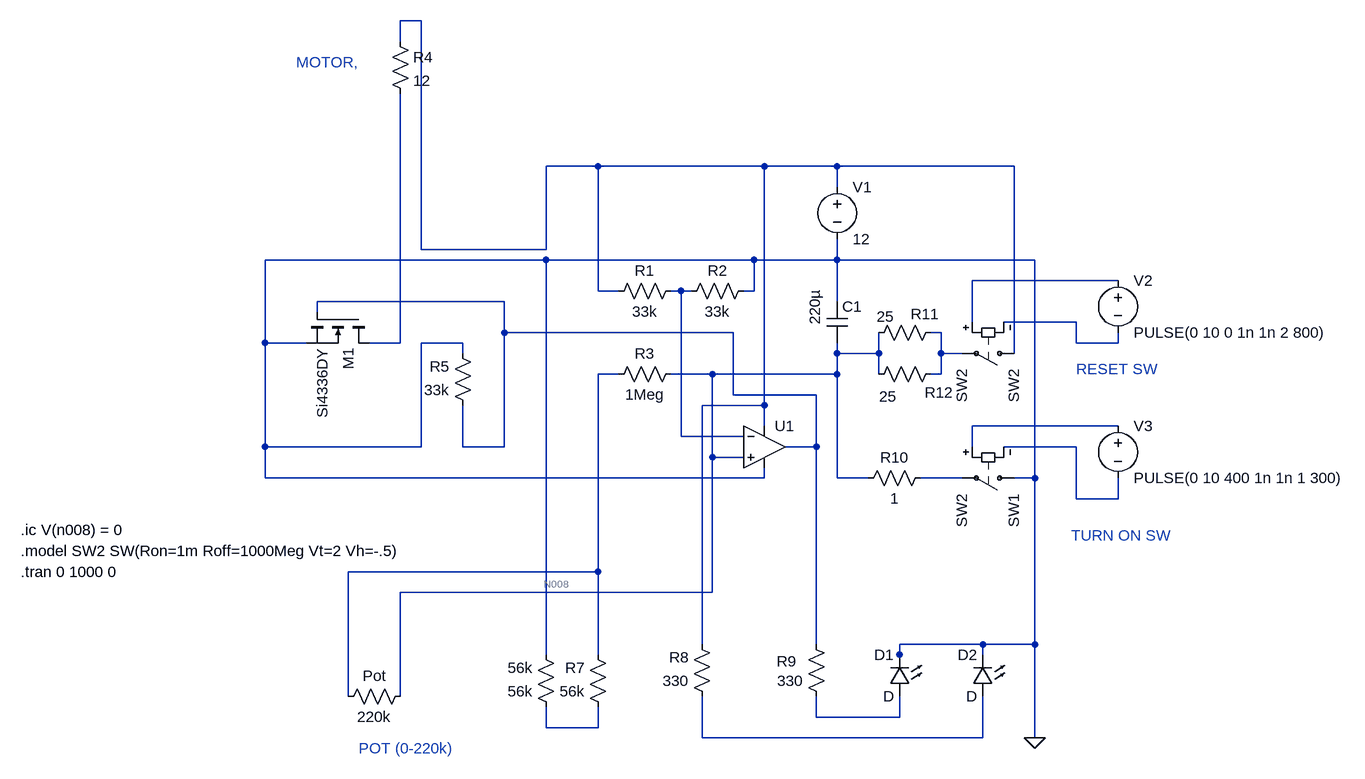
[diagram p0: schematic coffee-pump-timer-circuit.asc]
coffee-pump-timer-circuit.asc, the LTspice schematic file:
Version 4
SHEET 1 1792 704
WIRE -336 -432 -368 -432
WIRE -368 -400 -368 -432
WIRE -64 -208 -144 -208
WIRE 192 -208 -64 -208
WIRE 304 -208 192 -208
WIRE 576 -208 304 -208
WIRE 304 -176 304 -208
WIRE -336 -80 -336 -432
WIRE -144 -80 -144 -208
WIRE -144 -80 -336 -80
WIRE -144 -64 -576 -64
WIRE 176 -64 -144 -64
WIRE 304 -64 304 -96
WIRE 304 -64 176 -64
WIRE 608 -64 304 -64
WIRE 736 -32 512 -32
WIRE -64 -16 -64 -208
WIRE -32 -16 -64 -16
WIRE 64 -16 48 -16
WIRE 80 -16 64 -16
WIRE 176 -16 176 -64
WIRE 176 -16 160 -16
WIRE -208 0 -496 0
WIRE 304 0 304 -64
WIRE -496 16 -496 0
WIRE 512 32 512 -32
WIRE 672 32 560 32
WIRE -208 48 -208 0
WIRE 144 48 -208 48
WIRE 464 48 448 48
WIRE -576 64 -576 -64
WIRE -512 64 -576 64
WIRE -368 64 -368 -320
WIRE -368 64 -416 64
WIRE -272 64 -336 64
WIRE 672 64 672 32
WIRE 736 64 736 48
WIRE 736 64 672 64
WIRE -272 80 -272 64
WIRE 304 80 304 64
WIRE 368 80 368 48
WIRE 368 80 304 80
WIRE 464 80 464 48
WIRE 496 80 464 80
WIRE 576 80 576 -208
WIRE -32 112 -64 112
WIRE 112 112 48 112
WIRE 304 112 304 80
WIRE 304 112 112 112
WIRE 368 112 368 80
WIRE 464 112 464 80
WIRE 464 112 448 112
WIRE 144 144 144 48
WIRE 272 144 144 144
WIRE 192 160 192 -208
WIRE 192 160 96 160
WIRE 192 192 192 160
WIRE 736 192 512 192
WIRE 64 208 64 -16
WIRE 160 208 64 208
WIRE -576 224 -576 64
WIRE -336 224 -336 64
WIRE -336 224 -576 224
WIRE -272 224 -272 160
WIRE -208 224 -208 48
WIRE -208 224 -272 224
WIRE 272 224 272 144
WIRE 272 224 224 224
WIRE 512 224 512 192
WIRE 672 224 560 224
WIRE 112 240 112 112
WIRE 160 240 112 240
WIRE -576 272 -576 224
WIRE 192 272 192 256
WIRE 192 272 -576 272
WIRE 304 272 304 112
WIRE 352 272 304 272
WIRE 496 272 432 272
WIRE 608 272 608 -64
WIRE 608 272 576 272
WIRE 672 304 672 224
WIRE 736 304 736 272
WIRE 736 304 672 304
WIRE -64 416 -64 112
WIRE -64 416 -448 416
WIRE 112 448 112 240
WIRE 112 448 -368 448
WIRE 96 528 96 160
WIRE 272 528 272 224
WIRE 528 528 400 528
WIRE 608 528 608 272
WIRE 608 528 528 528
WIRE -144 544 -144 -64
WIRE -64 544 -64 416
WIRE 400 544 400 528
WIRE 528 544 528 528
WIRE 400 560 400 544
WIRE -448 608 -448 416
WIRE -368 608 -368 448
WIRE 272 640 272 608
WIRE 400 640 400 608
WIRE 400 640 272 640
WIRE -144 656 -144 624
WIRE -64 656 -64 624
WIRE -64 656 -144 656
WIRE 96 672 96 608
WIRE 528 672 528 608
WIRE 528 672 96 672
WIRE 608 672 608 528
FLAG 608 672 0
SYMBOL OpAmps\\UniversalOpAmp2 192 224 R0
SYMATTR InstName U1
SYMBOL LED 416 608 R180
WINDOW 0 24 64 Left 2
WINDOW 3 24 0 Left 2
SYMATTR InstName D1
SYMBOL LED 544 608 R180
WINDOW 0 24 64 Left 2
WINDOW 3 24 0 Left 2
SYMATTR InstName D2
SYMBOL cap 288 0 R0
WINDOW 3 -18 -18 VRight 2
SYMATTR Value 220µ
SYMATTR InstName C1
SYMBOL res 64 -32 R90
WINDOW 0 0 56 VBottom 2
WINDOW 3 32 56 VTop 2
SYMATTR InstName R1
SYMATTR Value 33k
SYMBOL res 176 -32 R90
WINDOW 0 0 56 VBottom 2
WINDOW 3 32 56 VTop 2
SYMATTR InstName R2
SYMATTR Value 33k
SYMBOL res 64 96 R90
WINDOW 0 0 56 VBottom 2
WINDOW 3 32 56 VTop 2
SYMATTR InstName R3
SYMATTR Value 1Meg
SYMBOL res -256 176 R180
WINDOW 0 36 76 Left 2
WINDOW 3 36 40 Left 2
SYMATTR InstName R5
SYMATTR Value 33k
SYMBOL res -128 640 R180
WINDOW 0 36 76 Left 2
WINDOW 3 36 40 Left 2
SYMATTR InstName 56k
SYMATTR Value 56k
SYMBOL res -48 640 R180
WINDOW 0 36 76 Left 2
WINDOW 3 36 40 Left 2
SYMATTR InstName R7
SYMATTR Value 56k
SYMBOL res 112 624 R180
WINDOW 0 36 76 Left 2
WINDOW 3 36 40 Left 2
SYMATTR InstName R8
SYMATTR Value 330
SYMBOL res 288 624 R180
WINDOW 0 46 70 Left 2
WINDOW 3 36 40 Left 2
SYMATTR InstName R9
SYMATTR Value 330
SYMBOL nmos -416 16 R90
SYMATTR InstName M1
SYMATTR Value Si4336DY
SYMBOL res 464 32 R90
WINDOW 0 3 25 VBottom 2
WINDOW 3 -24 86 VTop 2
SYMATTR InstName R11
SYMATTR Value 25
SYMBOL res 464 96 R90
WINDOW 0 60 3 VBottom 2
WINDOW 3 35 82 VTop 2
SYMATTR InstName R12
SYMATTR Value 25
SYMBOL voltage 304 -192 R0
WINDOW 123 0 0 Left 0
WINDOW 39 0 0 Left 0
SYMATTR InstName V1
SYMATTR Value 12
SYMBOL voltage 736 -48 R0
WINDOW 123 0 0 Left 0
WINDOW 39 0 0 Left 0
SYMATTR InstName V2
SYMATTR Value PULSE(0 10 0 1n 1n 2 800)
SYMBOL sw 592 80 R90
SYMATTR InstName SW2
SYMATTR Value SW2
SYMBOL sw 592 272 R90
SYMATTR InstName SW1
SYMATTR Value SW2
SYMBOL voltage 736 176 R0
WINDOW 123 0 0 Left 0
WINDOW 39 0 0 Left 0
SYMATTR InstName V3
SYMATTR Value PULSE(0 10 400 1n 1n 1 300)
SYMBOL res -384 -416 R0
SYMATTR InstName R4
SYMATTR Value 12
SYMBOL res -352 592 R90
WINDOW 0 0 56 VBottom 2
WINDOW 3 32 56 VTop 2
SYMATTR InstName Pot
SYMATTR Value 220k
SYMBOL res 448 256 R90
WINDOW 0 0 56 VBottom 2
WINDOW 3 32 56 VTop 2
SYMATTR InstName R10
SYMATTR Value 1
TEXT -952 416 Left 2 !.tran 0 1000 0
TEXT -952 384 Left 2 !.model SW2 SW(Ron=1m Roff=1000Meg Vt=2 Vh=-.5)
TEXT -952 352 Left 2 !.ic V(n008) = 0
TEXT -528 -368 Left 2 ;MOTOR,
TEXT -432 688 Left 2 ;POT (0-220k)
TEXT 664 360 Left 2 ;TURN ON SW
TEXT 672 104 Left 2 ;RESET SW

The netlist it stands for:
* coffee-pump-timer-circuit.asc
XU1 N008 N003 N001 0 N004 level2 Avol=1Meg GBW=10Meg Slew=10Meg Ilimit=25m Rail=0 Vos=0 En=0 Enk=0 In=0 Ink=0 Rin=500Meg  ; pins In+ In- V+ V- OUT
D1 N013 0 D
D2 N015 0 D
C1 0 N008 220µ
R1 N003 N001 33k
R2 0 N003 33k
R3 N008 N009 1Meg
R5 N004 0 33k
R§56k N014 0 56k
R7 N014 N009 56k
R8 N015 N001 330
R9 N013 N004 330
M1 N007 N004 0 0 Si4336DY
R11 N006 N008 25
R12 N006 N008 25
V1 N001 0 12
V2 N002 N005 PULSE(0 10 0 1n 1n 2 800)
SW2 N001 N006 N002 N005 SW2
SW1 0 N012 N010 N011 SW2
V3 N010 N011 PULSE(0 10 400 1n 1n 1 300)
R4 N001 N007 12
R§Pot N008 N009 220k
R10 N012 N008 1
.model D D
.lib standard.dio
.model NMOS NMOS
.model PMOS PMOS
.lib standard.mos
.tran 0 1000 0
.model SW2 SW(Ron=1m Roff=1000Meg Vt=2 Vh=-.5)
.ic V(n008) = 0
* MOTOR,
* POT (0-220k)
* TURN ON SW
* RESET SW
.lib UniversalOpAmp2.lib
.backanno
.end